# EAGLE design PAM8320 Amplifier Board R1 (EAGLE 9.6.2)
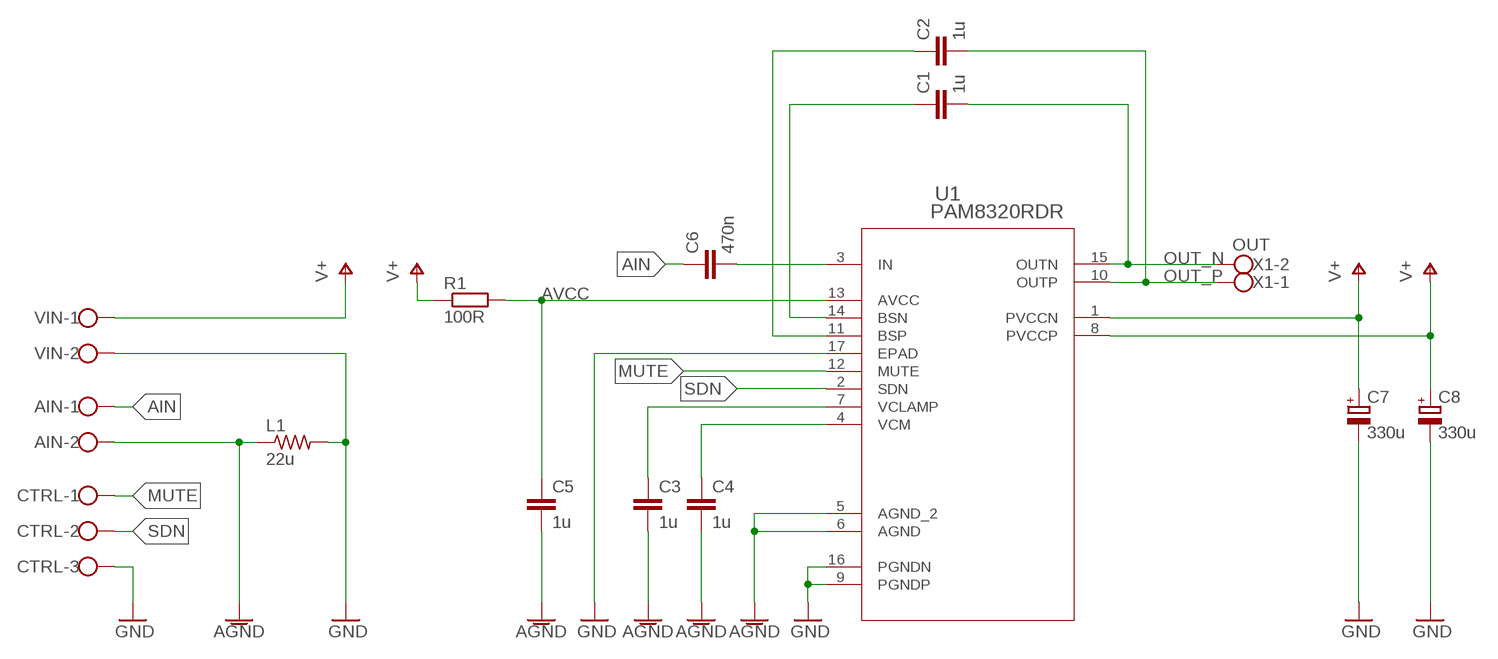
[diagram p0: schematic, sheet 1]

## Parts
AIN  W237-102  [W237-102]
C1  1u  C-EUC1206  [C1206]
C2  1u  C-EUC1206  [C1206]
C3  1u  C-EUC1206  [C1206]
C4  1u  C-EUC1206  [C1206]
C5  1u  C-EUC1206  [C1206]
C6  470n  C-EUC1206  [C1206]
C7  330u  CPOL-EUE3.5-8  [E3,5-8]
C8  330u  CPOL-EUE3.5-8  [E3,5-8]
CTRL  W237-103  [W237-103]
L1  22u  R-US_R0805  [R0805]
R1  100R  R-EU_R0603  [R0603]
U1  PAM8320RDR  [SO-16EP_3P9X9P9_DIO]
VIN  W237-102  [W237-102]
X1  OUT  W237-102  [W237-102]

## Nets
AGND: AIN.2 C3.2 C4.2 C5.2 L1.1 U1.5(AGND_2) U1.6(AGND)
AIN: AIN.1 C6.1
AVCC: C5.1 R1.2 U1.13(AVCC)
BSN: C1.1 U1.14(BSN)
BSP: C2.1 U1.11(BSP)
GND: C7.- C8.- CTRL.3 L1.2 U1.9(PGNDP) U1.16(PGNDN) U1.17(EPAD) VIN.2
MUTE: CTRL.1 U1.12(MUTE)
N$2: C3.1 U1.7(VCLAMP)
N$3: C4.1 U1.4(VCM)
N$6: C6.2 U1.3(IN)
OUT_N: C1.2 U1.15(OUTN) X1.2
OUT_P: C2.2 U1.10(OUTP) X1.1
SDN: CTRL.2 U1.2(SDN)
V+: C7.+ C8.+ R1.1 U1.1(PVCCN) U1.8(PVCCP) VIN.1

## Library data of the parts
AIN VIN X1 = con-wago-500:W237-102: WAGO SCREW CLAMP; MPN: 237-102; OC_FARNELL: unknown; OC_NEWARK: 70K9898
C1-C6 = rcl:C-EU: CAPACITOR, European symbol; SPICEPREFIX: C
C7 C8 = rcl:CPOL-EU: POLARIZED CAPACITOR, European symbol; SPICEPREFIX: C
CTRL = con-wago-500:W237-103: WAGO SCREW CLAMP; MPN: 237-103; OC_FARNELL: unknown; OC_NEWARK: 18M7116
L1 = rcl:R-US_: RESISTOR, American symbol; SPICEPREFIX: R
R1 = rcl:R-EU_: RESISTOR, European symbol; SPICEPREFIX: R
U1 = user:PAM8320RDR; COPYRIGHT: Copyright (C) 2023 Ultra Librarian. All rights reserved.; MANUFACTURER_PART_NUMBER: PAM8320RDR; MFR_NAME: Diodes Inc

## Board
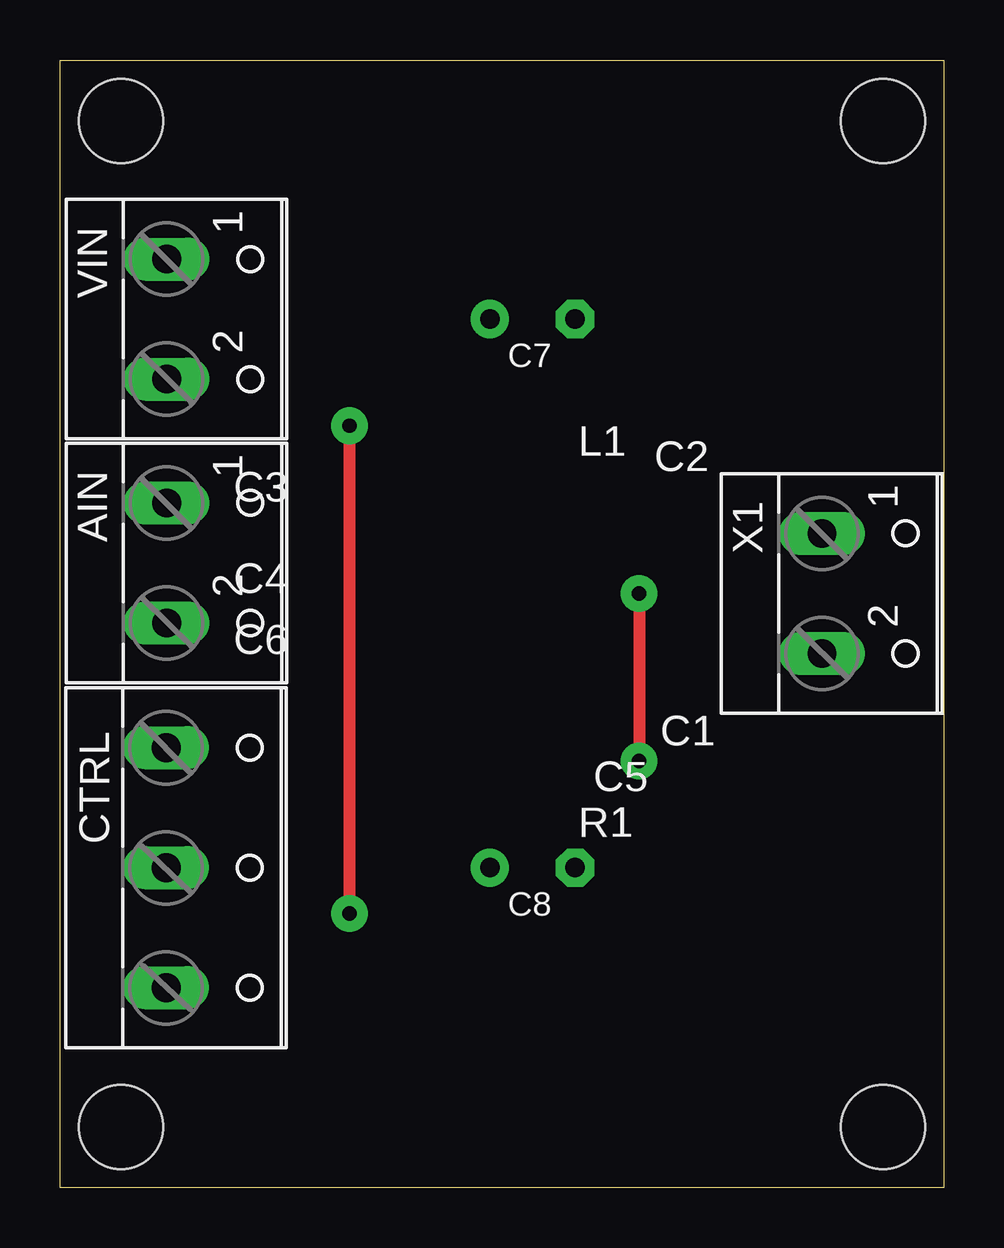
[diagram p1: board, top side]
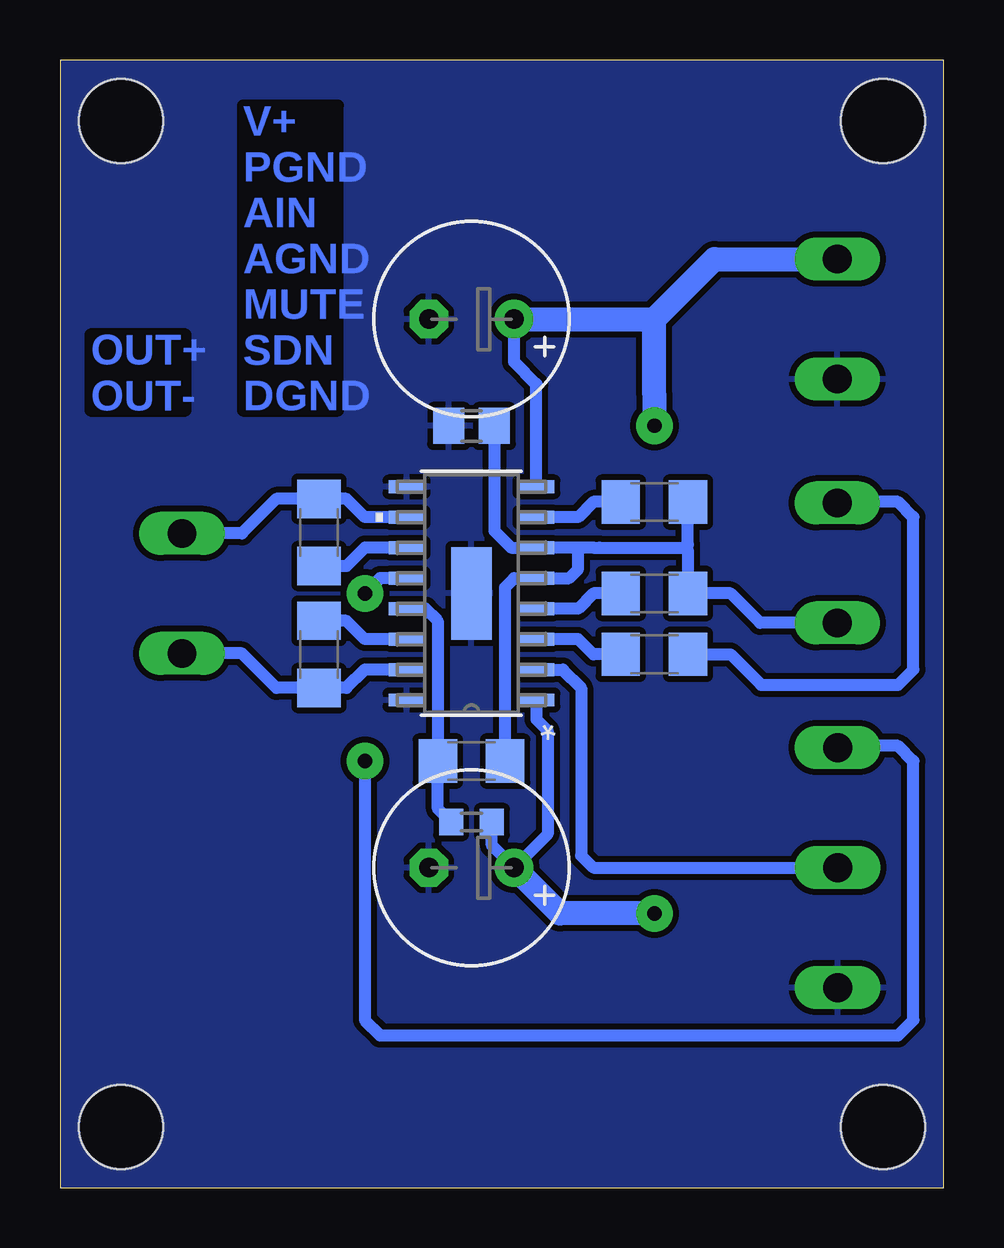
[diagram p2: board, bottom side, seen from below]

Size 36.83 x 46.99 mm. Coordinates in mm from the lower left corner, seen from the top.
Outline: 0,46.99 36.83,46.99 36.83,0 0,0 0,46.99
Copper layers (1*16): Top 0.035mm / dielectric 1.5mm / Bottom 0.035mm
Design rules "default *": minimum track width 0.2mm, minimum drill 0.35mm, track to track 0.25mm, track to pad 0.2mm, pad to pad 0.2mm, via to via 0.2mm, smd to smd 0.2mm, copper to edge 0.002540625mm, drill to drill 6mil, minimum pad ring 10mil, minimum via ring 8mil, stop-mask expansion 4mil, vias tented up to drill 0mil, thermal gap 0.25mm
Holes 3.5 mm at 2.54,44.45 34.29,44.45 2.54,2.54 34.29,2.54

### Footprints (pad centres in the part's own frame; a part is rotated, then mirrored left to right if it is on the bottom)
W237-102 = drill 1.194 long: 1 -2.5,-1.27; 2 2.5,-1.27
C1206 = smd 1.6 x 1.8: 1 -1.4,0; 2 1.4,0
E3,5-8 = drill 0.813 pad 1.6: + -1.778,0 | drill 0.813 pad 1.6 octagon: - 1.778,0
W237-103 = drill 1.194 long: 1 -5,-1.29; 2 0,-1.29; 3 5,-1.29
R0805 = smd 1.3 x 1.5: 1 -0.95,0; 2 0.95,0
R0603 = smd 1 x 1.1: 1 -0.85,0; 2 0.85,0
SO-16EP_3P9X9P9_DIO = smd 1.499 x 0.533: 1 -2.705,4.445; 2 -2.705,3.175; 3 -2.705,1.905; 4 -2.705,0.635; 5 -2.705,-0.635; 6 -2.705,-1.905; 7 -2.705,-3.175; 8 -2.705,-4.445; 9 2.705,-4.445; 10 2.705,-3.175; 11 2.705,-1.905; 12 2.705,-0.635; 13 2.705,0.635; 14 2.705,1.905; 15 2.705,3.175; 16 2.705,4.445 | smd 1.676 x 3.861: 17 0,0

### Placement (x,y rotation side)
AIN  5.71,26.04 270 top
C1  26.04,22.23 270 bottom
C2  26.04,27.3 90 bottom
C3  12.07,28.58 0 bottom
C4  12.07,24.77 0 bottom
C5  19.68,17.78 0 bottom
C6  12.07,22.23 180 bottom
C7  19.68,36.2 180 bottom
C8  19.68,13.33 180 bottom
CTRL  5.71,13.33 270 top
L1  19.68,31.75 180 bottom
R1  19.68,15.24 180 bottom
U1  19.68,24.77 180 bottom
VIN  5.71,36.2 270 top
X1  33.02,24.77 270 top

### Tracks (layer width: path | path; a pad name or v marks a point on that pad's centre or on a via)
AGND
  Bottom 0.5: C5.2 18.29,25.02 17.91,25.4 U1.5 15.62,25.4 15.24,25.78 15.24,26.67 | L1.1 18.73,27.37 18.03,26.67 U1.6 15.24,26.67 | AIN.2 7.66,23.54 8.89,24.77 C4.2 10.66,26.54 10.79,26.67 | 15.24,26.67 14.61,26.67 14.35,26.67 10.79,26.67 | 10.79,26.67 10.66,26.8 C3.2
AIN
  Bottom 0.5: C6.1 8.89,22.23 7.62,20.96 1.9,20.96 1.27,21.59 1.27,27.94 1.9,28.58 4.4,28.58 AIN.1
AVCC
  Bottom 0.5: U1.13 21.61,24.13 21.1,23.62 21.1,17.8 C5.1 21.08,15.79 R1.2
BSN
  Bottom 0.5: U1.14 24.13,22.86 24.89,23.62 C1.1
BSP
  Bottom 0.5: U1.11 24.13,26.67 24.89,25.91 C2.1
GND
  pour Bottom: -0.64,47.62 37.47,47.62 37.47,-0.63 -0.64,-0.63
MUTE  (via drill 0.6 pad 1.52)
  Top 0.5: v24.13,24.77 v24.13,17.78
  Bottom 0.5: U1.12 23.5,25.4 v24.13,24.77 | v24.13,17.78 24.13,6.99 23.5,6.35 1.9,6.35 1.27,6.99 1.27,17.78 1.9,18.41 4.34,18.41 CTRL.1
N$2
  Bottom 0.5: C3.1 14.61,28.58 15.24,27.94 U1.7
N$3
  Bottom 0.5: C4.1 14.61,24.77 15.24,24.13 U1.4
N$6
  Bottom 0.5: C6.2 14.61,22.23 15.24,22.86 U1.3
OUT_N
  Bottom 0.5: U1.15 24.13,21.59 24.89,20.83 C1.2 27.81,20.83 29.25,22.27 X1.2
OUT_P
  Bottom 0.5: U1.10 24.13,27.94 24.89,28.71 C2.2 27.81,28.71 29.25,27.27 X1.1
SDN
  Bottom 0.5: U1.2 15.87,21.59 15.11,20.83 15.11,13.84 14.61,13.33 CTRL.2
V+  (via drill 0.6 pad 1.52)
  Top 0.5: v12.07,11.43 v12.07,31.75
  Bottom 0.5: U1.1 16.98,19.52 16.51,19.05 16.51,14.73 C8.+ 18.83,14.26 R1.1 | U1.8 16.98,33.49 17.91,34.42 C7.+
  Bottom 1: v12.07,11.43 16,11.43 C8.+ | C7.+ 12.07,36.2 | v12.07,31.75 12.07,33.02 12.07,36.2 | 12.07,36.2 9.57,38.7 VIN.1

### Text on the board
Bottom: V+ / PGND / AIN / AGND / MUTE / SDN / DGND | OUT+ / OUT-